# Altium schematic sheet Cover.SchDoc: Cover Sheet
size A3; ApprovedBy: Betül DEMİRHAN; CheckedBy: UDEMY; DrawnBy: Furkan DEMİRHAN; Revision: 01; SheetNumber: 1; SheetTotal: 5; ENG_APP_DATE: --/--/--; DSN_APP_DATE: --/--/--; CHK_APP_DATE: --/--/--; ProjectDescription: Wireless Security Detector; ReleaseDate: 27.07.2024
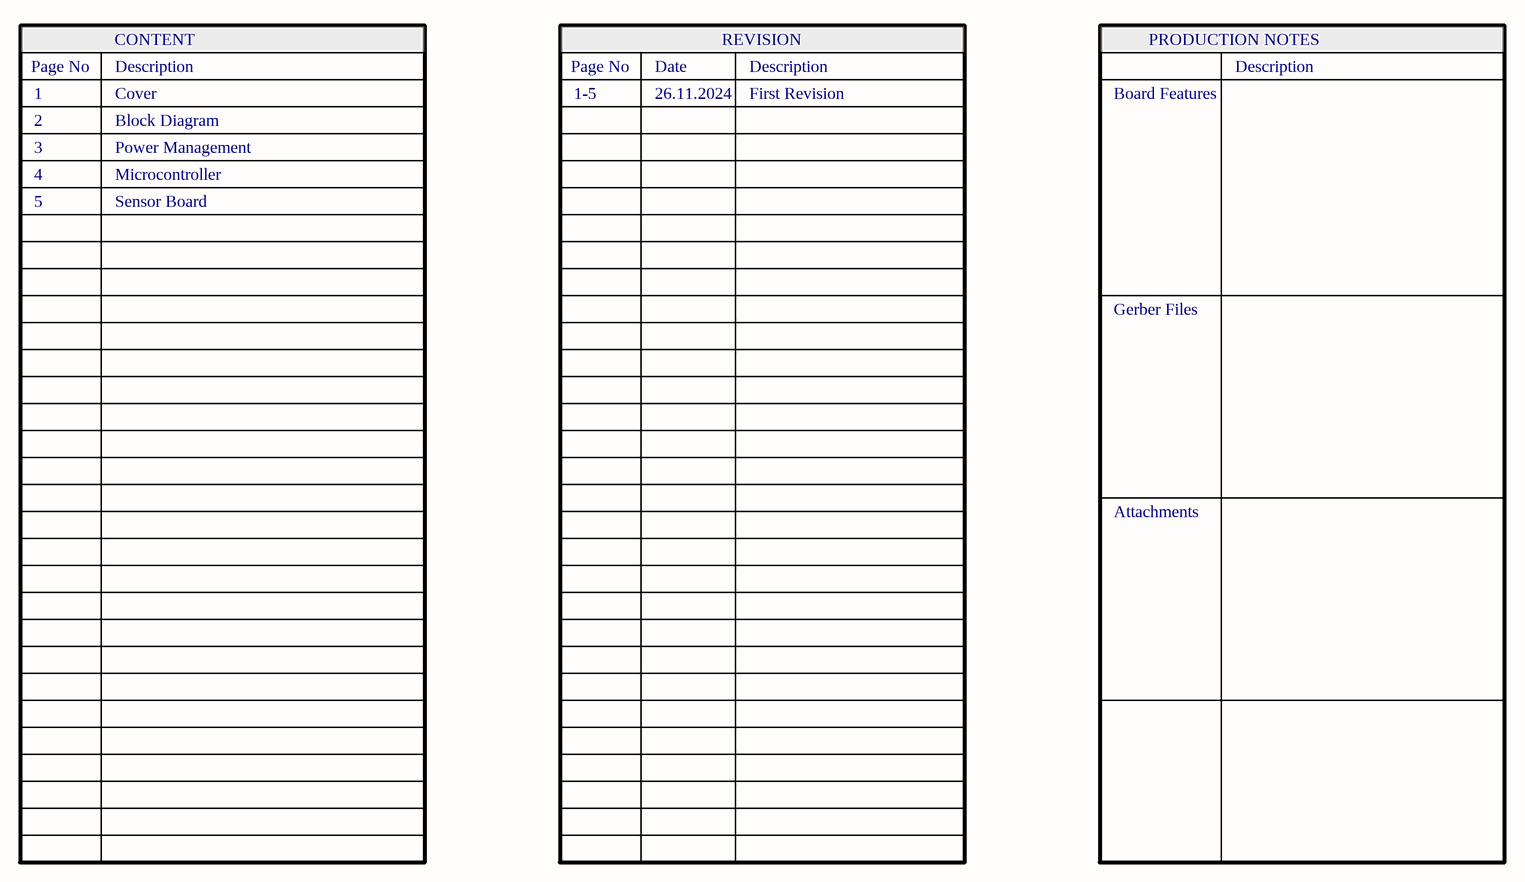
[diagram p0: Cover.SchDoc]

## Notes on the sheet
- CONTENT
- REVISION
- PRODUCTION NOTES
- 1
- 2
- Page No
- Description
- Cover
- Block Diagram
- 1-5
- Date
- 26.11.2024
- First Revision
- Board Features
- 3
- 4
- Power Management
- Microcontroller
- 5
- Sensor Board
- Gerber Files
- Attachments
- DOCUMENT NAME
- DESCRIPTION
- DRAWN BY
- RELEASE DATE
- CHECKED BY
- CHANGE DATE
- APPROVED BY
- DEPARTMENT
- R&D Hardware
- SIZE
- A3
- SHEET
- /